# EAGLE design TSAL_inverter_voltage_measurement_TNN_V1.0 (EAGLE 9.6.2)
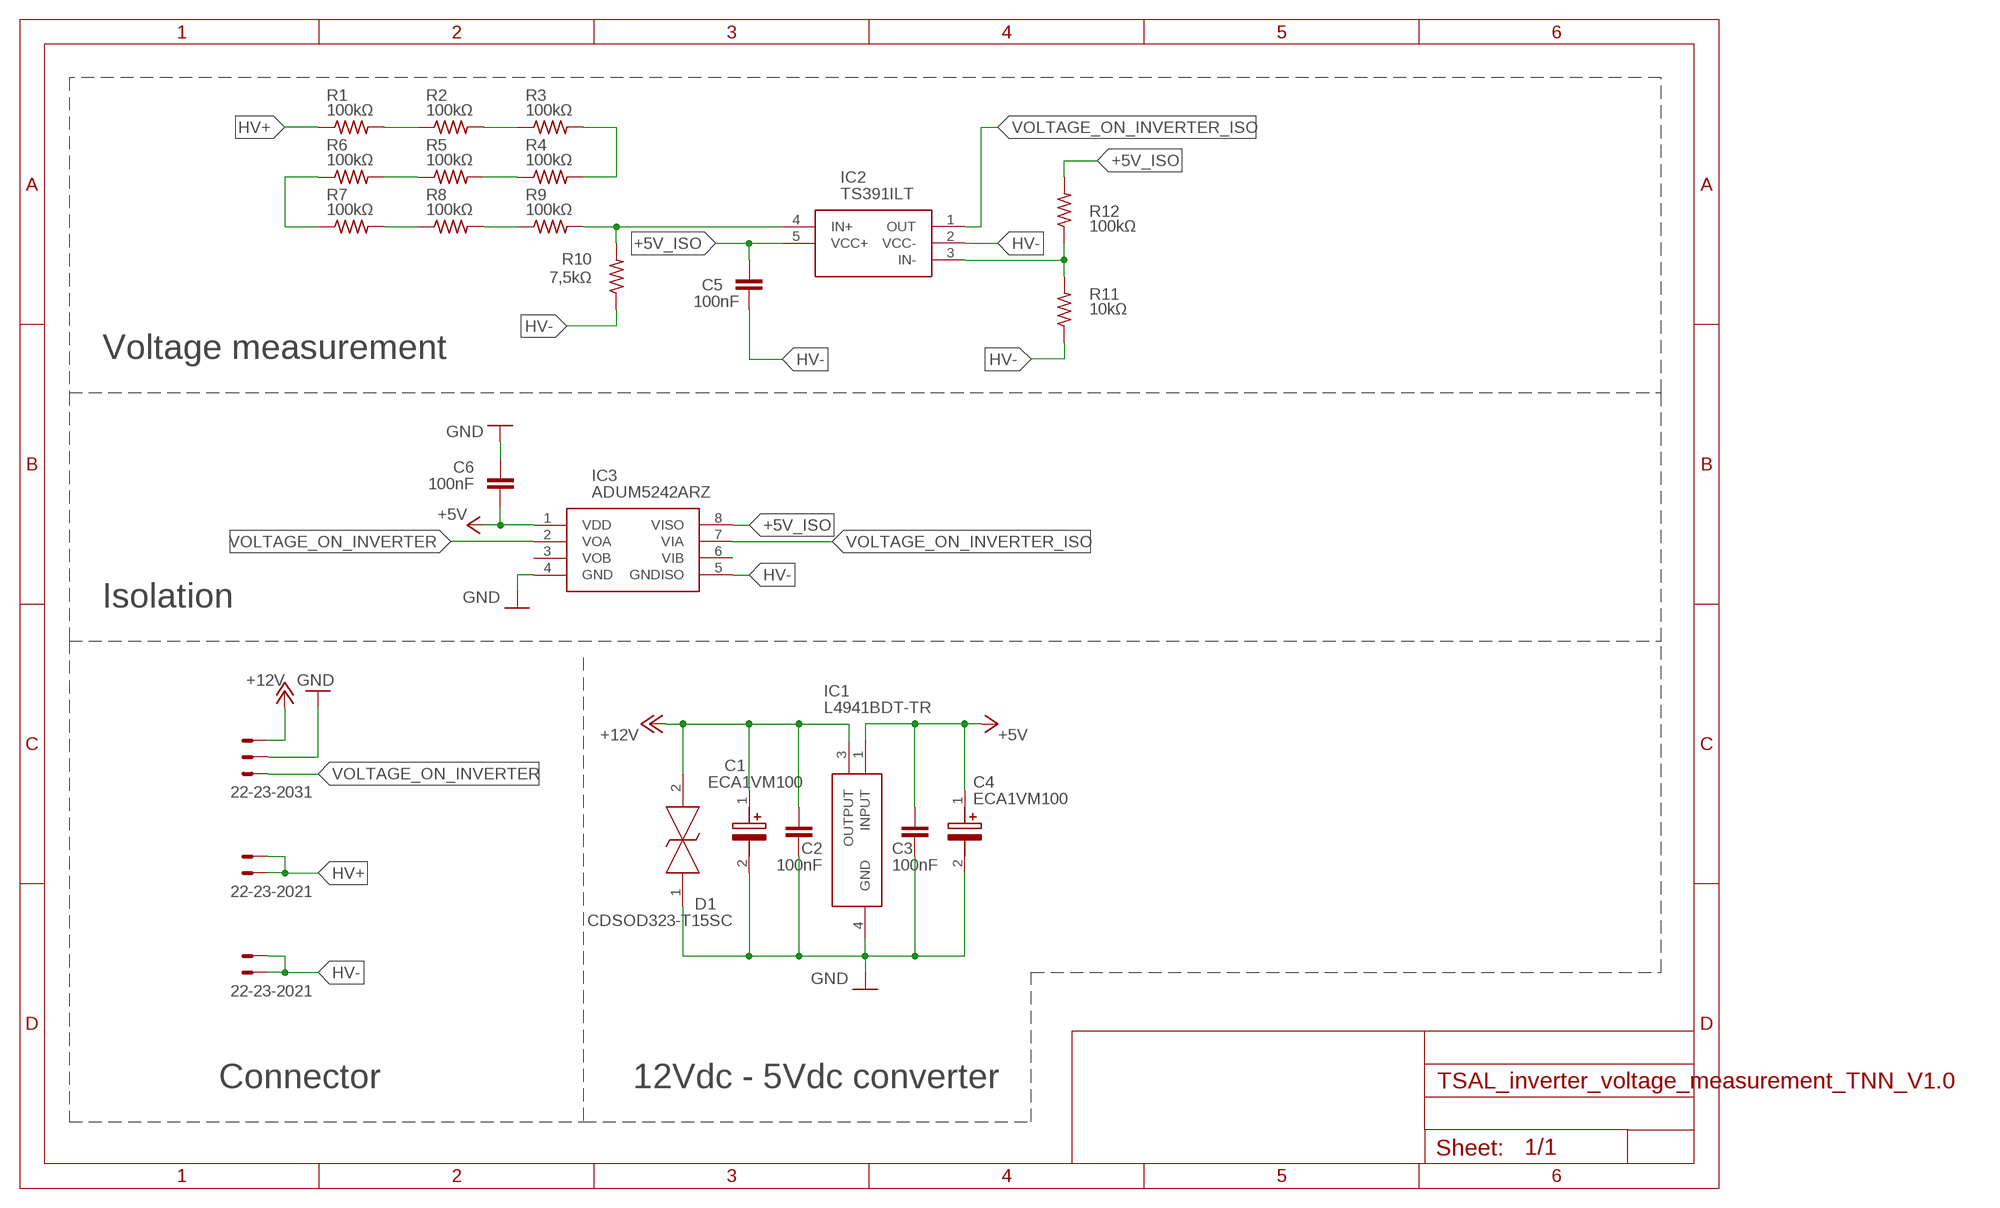
[diagram p0: schematic, sheet 1]

## Parts
C1  ECA1VM100  [CAPPRD200W55D525H1200]
C2  100nF  C-EUC0603  [C0603]
C3  100nF  C-EUC0603  [C0603]
C4  ECA1VM100  [CAPPRD200W55D525H1200]
C5  100nF  C-EUC0603  [C0603]
C6  100nF  C-EUC0603  [C0603]
D1  CDSOD323-T15SC  [SOD-323]
HV+  22-23-2021  [22-23-2021]
HV-  22-23-2021  [22-23-2021]
IC1  L4941BDT-TR  [TO228P972X240-3N]
IC2  TS391ILT  [SOT95P280X145-5N]
IC3  ADUM5242ARZ  [SOIC127P600X175-8N]
LOW_VOLTAGE  22-23-2031  [22-23-2031]
R1  100kΩ  R-US_R0603  [R0603]
R2  100kΩ  R-US_R0603  [R0603]
R3  100kΩ  R-US_R0603  [R0603]
R4  100kΩ  R-US_R0603  [R0603]
R5  100kΩ  R-US_R0603  [R0603]
R6  100kΩ  R-US_R0603  [R0603]
R7  100kΩ  R-US_R0603  [R0603]
R8  100kΩ  R-US_R0603  [R0603]
R9  100kΩ  R-US_R0603  [R0603]
R10  7,5kΩ  R-US_R0603  [R0603]
R11  10kΩ  R-US_R0603  [R0603]
R12  100kΩ  R-US_R0603  [R0603]

## Nets
+5V: C3.2 C4.1(+) C6.1 IC1.1(INPUT) IC3.1(VDD)
+5V_ISO: C5.2 IC2.5(VCC+) IC3.8(VISO) R12.2
+12V: C1.1(+) C2.2 D1.2 IC1.3(OUTPUT) LOW_VOLTAGE.3
GND: C1.2(-) C2.1 C3.1 C4.2(-) C6.2 D1.1 IC1.4(GND) IC3.4(GND) LOW_VOLTAGE.2
HV+: HV+.1 HV+.2 R1.1
HV-: C5.1 HV-.1 HV-.2 IC2.2(VCC-) IC3.5(GNDISO) R10.1 R11.1
N$2: R1.2 R2.1
N$3: R2.2 R3.1
N$4: R3.2 R4.2
N$5: R4.1 R5.2
N$6: R5.1 R6.2
N$7: R6.1 R7.1
N$8: R7.2 R8.1
N$9: R8.2 R9.1
N$10: IC2.4(IN+) R9.2 R10.2
N$11: IC2.3(IN-) R11.2 R12.1
VOLTAGE_ON_INVERTER: IC3.2(VOA) LOW_VOLTAGE.1
VOLTAGE_ON_INVERTER_ISO: IC2.1(OUT) IC3.7(VIA)
Unconnected: IC3.3(VOB) IC3.6(VIB)

## Notes on the sheet
- Voltage measurement
- Isolation
- Connector | 12Vdc - 5Vdc converter

## Library data of the parts
C1 C4 = ECA1VM100:ECA1VM100: M radial Al elect cap,10uF 35V 85deg C Panasonic 10uF 35 V dc Aluminium Electrolytic Capacitor, M Series 2000h Source: Datasheet <http://industrial.panasonic.com/cdbs/www-data/pdf/RDF0000/ABA0000C1218.pdf>; DESCRIPTION: M radial Al elect cap,10uF 35V 85deg C Panasonic 10uF 35 V dc Aluminium Electrolytic Capacitor, M Series 2000h; HEIGHT: 12mm; MANUFACTURER_NAME: Panasonic; MANUFACTURER_PART_NUMBER: ECA1VM100
C2 C3 C5 C6 = rcl:C-EU: CAPACITOR, European symbol; SPICEPREFIX: C
D1 = CDSOD323-T15SC:CDSOD323-T15SC: TVS Diode ESD 15V BiDirectional SOD323 Bourns CDSOD323-T15SC Bi-Directional TVS Diode, 400W peak, 2-Pin SOD-323 Source: Datasheet <https://datasheet.datasheetarchive.com/originals/distributors/Datasheets-DGA26/1841678.pdf>; ARROW_PART_NUMBER: CDSOD323-T15SC; ARROW_PRICE-STOCK: https://www.arrow.com/en/products/cdsod323-t15sc/bourns?region=nac; DESCRIPTION: TVS Diode ESD 15V BiDirectional SOD323 Bourns CDSOD323-T15SC Bi-Directional TVS Diode, 400W peak, 2-Pin SOD-323; HEIGHT: mm; MANUFACTURER_NAME: Bourns; MANUFACTURER_PART_NUMBER: CDSOD323-T15SC; MOUSER_PART_NUMBER: 652-CDSOD323-T15SC; MOUSER_PRICE-STOCK: https://www.mouser.co.uk/ProductDetail/Bourns/CDSOD323-T15SC?qs=6S5Watp5UnLvz%2FtnS7XuhA%3D%3D
HV+ HV- = con-molex:22-23-2021: .100" (2.54mm) Center Header - 2 Pin; MF: MOLEX; MPN: 22-23-2021; OC_FARNELL: 1462926; OC_NEWARK: 25C3832
IC1 = L4941BDT-TR:L4941BDT-TR: L4941BDT-TR, Low Dropout Voltage Regulator, 1A, 5 V +/-4%, 3-Pin DPAK Source: Datasheet <http://www.st.com/web/en/resource/technical/document/datasheet/CD00000443.pdf>; ARROW_PART_NUMBER: L4941BDT-TR; ARROW_PRICE-STOCK: https://www.arrow.com/en/products/l4941bdt-tr/stmicroelectronics?region=nac; DESCRIPTION: L4941BDT-TR, Low Dropout Voltage Regulator, 1A, 5 V +/-4%, 3-Pin DPAK; HEIGHT: 2.4mm; MANUFACTURER_NAME: STMicroelectronics; MANUFACTURER_PART_NUMBER: L4941BDT-TR; MOUSER_PART_NUMBER: 511-L4941BDT-TR; MOUSER_PRICE-STOCK: https://www.mouser.co.uk/ProductDetail/STMicroelectronics/L4941BDT-TR?qs=tPFdqECvbMIySYN92F2N4Q%3D%3D
IC2 = TS391ILT:TS391ILT: TS391ILT, Comparator Open Collector 0.3us 12 V, 15 V, 18 V, 24 V, 28 V, 3 V, 5 V, 9 V 5-Pin SOT-23 Source: Datasheet <http://www.st.com/st-web-ui/static/active/en/resource/technical/document/datasheet/CD00001660.pdf>; ARROW_PART_NUMBER: TS391ILT; ARROW_PRICE-STOCK: https://www.arrow.com/en/products/ts391ilt/stmicroelectronics?region=nac; DESCRIPTION: TS391ILT, Comparator Open Collector 0.3us 12 V, 15 V, 18 V, 24 V, 28 V, 3 V, 5 V, 9 V 5-Pin SOT-23; HEIGHT: 1.45mm; MANUFACTURER_NAME: STMicroelectronics; MANUFACTURER_PART_NUMBER: TS391ILT; MOUSER_PART_NUMBER: 511-TS391IL; MOUSER_PRICE-STOCK: https://www.mouser.co.uk/ProductDetail/STMicroelectronics/TS391ILT?qs=P8h1tZw8GcB9GWR61XM17g%3D%3D
IC3 = ADUM5242ARZ:ADUM5242ARZ: Analog Devices ADUM5242ARZ PCB SMT 2-channel Digital Isolator, 2500 V, 8-Pin SOIC Source: Datasheet; ARROW_PART_NUMBER: ADUM5242ARZ; ARROW_PRICE-STOCK: https://www.arrow.com/en/products/adum5242arz/analog-devices; DESCRIPTION: Analog Devices ADUM5242ARZ PCB SMT 2-channel Digital Isolator, 2500 V, 8-Pin SOIC; HEIGHT: mm; MANUFACTURER_NAME: Analog Devices; MANUFACTURER_PART_NUMBER: ADUM5242ARZ; MOUSER_PART_NUMBER: 584-ADUM5242ARZ; MOUSER_PRICE-STOCK: https://www.mouser.co.uk/ProductDetail/Analog-Devices/ADUM5242ARZ?qs=WIvQP4zGanhQ0%252B41E0Savw%3D%3D
LOW_VOLTAGE = con-molex:22-23-2031: .100" (2.54mm) Center Header - 3 Pin; MF: MOLEX; MPN: 22-23-2031; OC_FARNELL: 1462950; OC_NEWARK: 30C0862
R1-R12 = rcl:R-US_: RESISTOR, American symbol; SPICEPREFIX: R

## Board
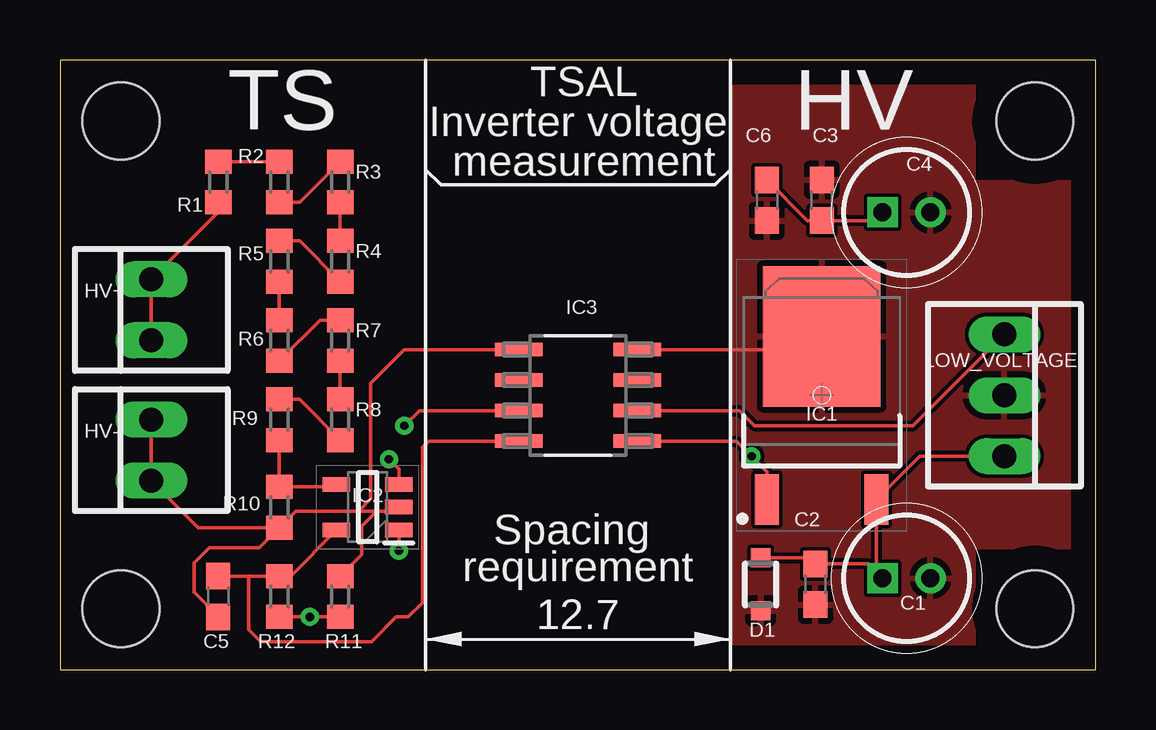
[diagram p1: board, top side]
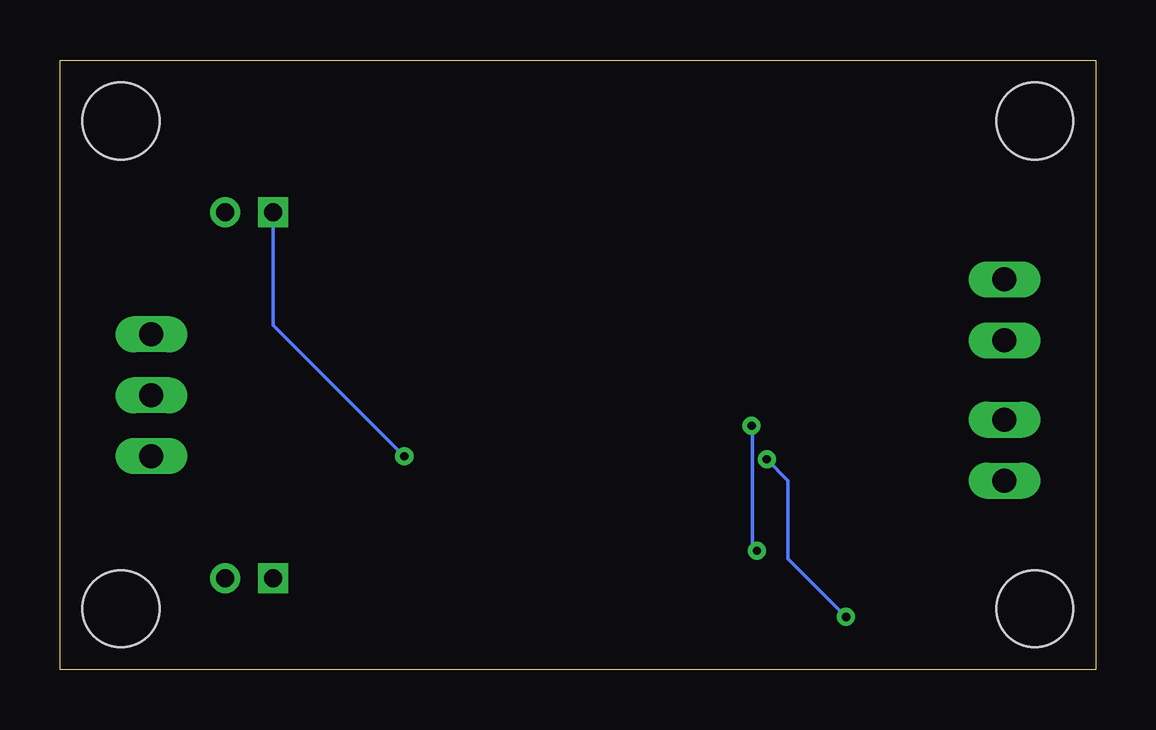
[diagram p2: board, bottom side, seen from below]

Size 43.18 x 25.4 mm. Coordinates in mm from the lower left corner, seen from the top.
Outline: 0,25.4 0,0 43.18,0 43.18,25.4 0,25.4
Copper layers (1*16): Top 0.035mm / dielectric 1.5mm / Bottom 0.035mm
Design rules "default": minimum track width 6mil, minimum drill 0.35mm, track to track 6mil, track to pad 6mil, pad to pad 6mil, via to via 6mil, smd to smd 6mil, copper to edge 40mil, drill to drill 6mil, minimum pad ring 10mil, minimum via ring 8mil, stop-mask expansion 4mil, vias tented up to drill 0mil, thermal gap 10mil
Holes 3.2 mm at 2.54,2.54 2.54,22.86 40.64,2.54 40.64,22.86

### Footprints (pad centres in the part's own frame; a part is rotated, then mirrored left to right if it is on the bottom)
CAPPRD200W55D525H1200 = drill 0.75 pad 1.15 square: 1 0,0 | drill 0.75 pad 1.15: 2 2,0
C0603 = smd 1.1 x 1: 1 -0.85,0; 2 0.85,0
SOD-323 = smd 0.8 x 0.8: 1 -1.1,0; 2 1.1,0
22-23-2021 = drill 1 long: 1 -1.27,0; 2 1.27,0
TO228P972X240-3N = smd 2.1 x 1: 1 -4.35,2.28; 3 -4.35,-2.28 | smd 5.85 x 4.9: 4 2.45,0
SOT95P280X145-5N = smd 1.15 x 0.6: 1 -1.3,0.95; 2 -1.3,0; 3 -1.3,-0.95; 4 1.3,-0.95; 5 1.3,0.95
SOIC127P600X175-8N = smd 1.981 x 0.559: 1 -2.464,1.905; 2 -2.464,0.635; 3 -2.464,-0.635; 4 -2.464,-1.905; 5 2.464,-1.905; 6 2.464,-0.635; 7 2.464,0.635; 8 2.464,1.905
22-23-2031 = drill 1 long: 1 -2.54,0; 2 0,0; 3 2.54,0
R0603 = smd 1 x 1.1: 1 -0.85,0; 2 0.85,0

### Placement (x,y rotation side)
C1  34.29,3.81 0 top
C2  31.5,3.56 90 top
C3  31.75,19.56 270 top
C4  34.29,19.05 0 top
C5  6.6,3.05 90 top
C6  29.46,19.56 270 top
D1  29.21,3.56 90 top
HV+  3.81,14.99 90 top
HV-  3.81,9.14 90 top
IC1  31.75,11.43 90 top
IC2  12.83,6.77 180 top
IC3  21.59,11.43 180 top
LOW_VOLTAGE  39.37,11.43 270 top
R1  6.6,20.32 90 top
R2  9.14,20.32 270 top
R3  11.68,20.32 270 top
R4  11.68,17.02 90 top
R5  9.14,17.02 90 top
R6  9.14,13.72 90 top
R7  11.68,13.72 270 top
R8  11.68,10.41 270 top
R9  9.14,10.41 270 top
R10  9.14,6.77 90 top
R11  11.68,3.05 270 top
R12  9.14,3.05 90 top

### Tracks (layer width: path | path; a pad name or v marks a point on that pad's centre or on a via)
+5V  (via drill 0.35)
  Top 0.152: IC3.1 28.19,9.53 v28.83,8.89 29.47,8.25 IC1.1 | C4.1 33.95,18.71 C3.2 31.16,18.71 C6.1
  Bottom 0.152: v28.83,8.89 34.29,14.35 C4.1
+5V_ISO
  Top 0.152: C5.2 7.87,3.9 | 7.87,3.9 R12.2 9.61,3.9 IC2.5 | 7.87,3.9 7.87,1.65 8.36,1.17 12.98,1.17 14.01,2.2 14.52,2.2 15.11,2.79 15.11,9.27 15.37,9.53 IC3.8
+12V
  Top 0.152: LOW_VOLTAGE.3 35.84,8.89 IC1.3 34.03,4.07 C1.1 33.69,4.41 C2.2 31.25,4.66 D1.2
GND
  Top 0.152: IC3.4 31.21,13.33 IC1.4
  pour Top: 27.94,25.4 27.94,0 38.1,0 38.1,5.08 43.18,5.08 43.18,20.32 38.1,20.32 38.1,25.4
HV+
  Top 0.152: HV+.1 HV+.2 6.6,19.05 R1.1
HV-
  Top 0.152: HV-.2 HV-.1 5.77,5.92 R10.1 | R10.1 8.31,5.08 6.22,5.08 5.59,4.45 5.59,3.21 C5.1 | IC2.2 13.96,6.6 13.21,6.6 | 13.21,6.6 12.57,5.97 12.57,4.79 R11.1 | R10.1 9.83,6.6 12.45,6.6 | 12.45,6.6 13.21,6.6 | IC3.5 14.35,13.33 12.95,11.94 12.95,7.11 12.45,6.6
N$2
  Top 0.152: R1.2 R2.1
N$3
  Top 0.152: R2.2 9.98,19.47 R3.1
N$4
  Top 0.152: R3.2 R4.2
N$5
  Top 0.152: R4.1 9.98,17.87 R5.2
N$6
  Top 0.152: R5.1 R6.2
N$7
  Top 0.152: R6.1 10.84,14.57 R7.1
N$8
  Top 0.152: R7.2 R8.1
N$9
  Top 0.152: R8.2 9.98,11.26 R9.1
N$10
  Top 0.152: R9.2 R10.2 11.43,7.62 IC2.4
N$11  (via drill 0.35)
  Top 0.152: R12.1 v10.41,2.2 R11.2 | IC2.3 14.13,8.35 v13.72,8.76
  Bottom 0.152: v13.72,8.76 12.83,7.87 12.83,4.61 v10.41,2.2
VOLTAGE_ON_INVERTER
  Top 0.152: IC3.2 28.32,10.79 28.96,10.16 35.56,10.16 LOW_VOLTAGE.1
VOLTAGE_ON_INVERTER_ISO  (via drill 0.35)
  Top 0.152: IC2.1 v14.13,4.95 | IC3.7 14.99,10.79 v14.35,10.16
  Bottom 0.152: v14.13,4.95 14.13,5.01 14.32,5.21 14.32,10.13 v14.35,10.16

### Text on the board
tNames: TSAL / Inverter voltage / measurement | TS | HV | Spacing / requirement